# EAGLE design head board (EAGLE 7.5.0)
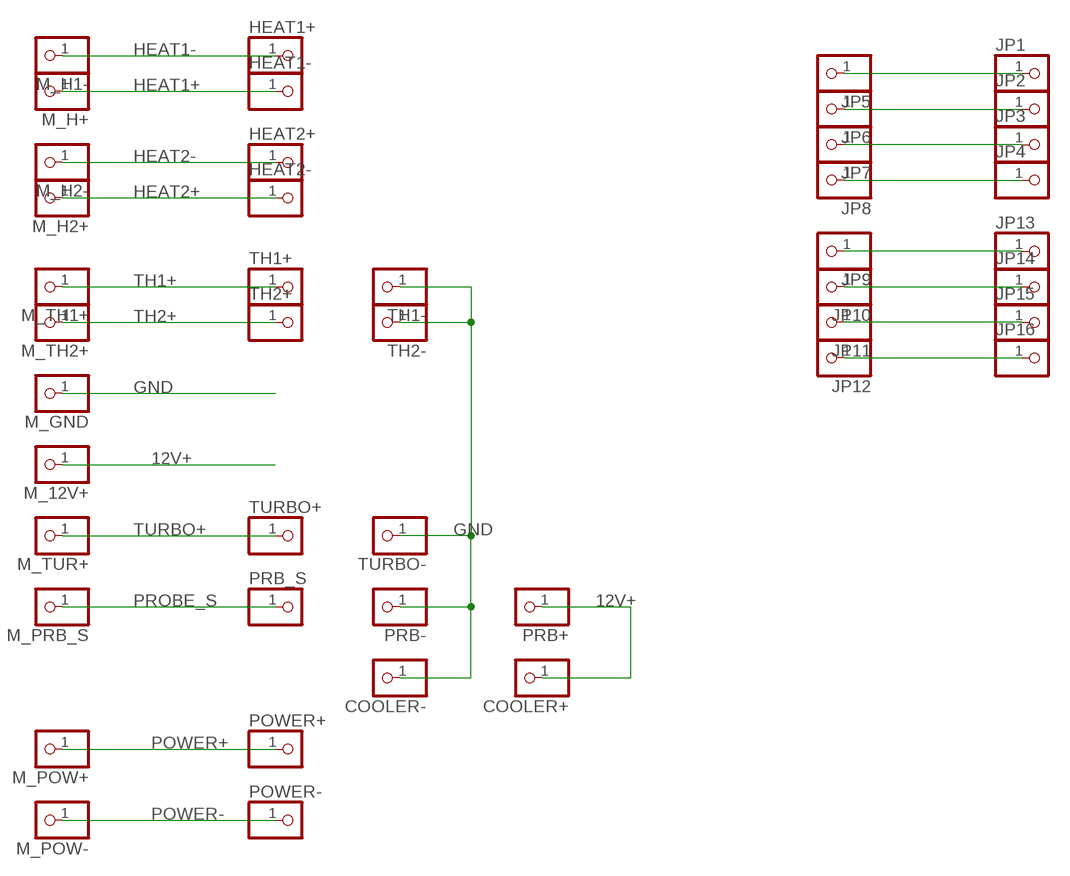
[diagram p0: schematic, sheet 1]

## Parts
COOLER+  PINHD-1X1  [1X01]
COOLER-  PINHD-1X1  [1X01]
HEAT1+  PINHD-1X1  [1X01]
HEAT1-  PINHD-1X1  [1X01]
HEAT2+  PINHD-1X1  [1X01]
HEAT2-  PINHD-1X1  [1X01]
JP1  PINHD-1X1  [1X01]
JP2  PINHD-1X1  [1X01]
JP3  PINHD-1X1  [1X01]
JP4  PINHD-1X1  [1X01]
JP5  PINHD-1X1  [1X01]
JP6  PINHD-1X1  [1X01]
JP7  PINHD-1X1  [1X01]
JP8  PINHD-1X1  [1X01]
JP9  PINHD-1X1  [1X01]
JP10  PINHD-1X1  [1X01]
JP11  PINHD-1X1  [1X01]
JP12  PINHD-1X1  [1X01]
JP13  PINHD-1X1  [1X01]
JP14  PINHD-1X1  [1X01]
JP15  PINHD-1X1  [1X01]
JP16  PINHD-1X1  [1X01]
M_12V+  PINHD-1X1  [1X01]
M_GND  PINHD-1X1  [1X01]
M_H1-  PINHD-1X1  [1X01]
M_H2+  PINHD-1X1  [1X01]
M_H2-  PINHD-1X1  [1X01]
M_H+  PINHD-1X1  [1X01]
M_POW+  PINHD-1X1  [1X01]
M_POW-  PINHD-1X1  [1X01]
M_PRB_S  PINHD-1X1  [1X01]
M_TH1+  PINHD-1X1  [1X01]
M_TH2+  PINHD-1X1  [1X01]
M_TUR+  PINHD-1X1  [1X01]
POWER+  PINHD-1X1  [1X01]
POWER-  PINHD-1X1  [1X01]
PRB+  PINHD-1X1  [1X01]
PRB-  PINHD-1X1  [1X01]
PRB_S  PINHD-1X1  [1X01]
TH1+  PINHD-1X1  [1X01]
TH1-  PINHD-1X1  [1X01]
TH2+  PINHD-1X1  [1X01]
TH2-  PINHD-1X1  [1X01]
TURBO+  PINHD-1X1  [1X01]
TURBO-  PINHD-1X1  [1X01]

## Nets
12V+: COOLER+.1 M_12V+.1 PRB+.1
GND: COOLER-.1 M_GND.1 PRB-.1 TH1-.1 TH2-.1 TURBO-.1
HEAT1+: HEAT1-.1 M_H+.1
HEAT1-: HEAT1+.1 M_H1-.1
HEAT2+: HEAT2-.1 M_H2+.1
HEAT2-: HEAT2+.1 M_H2-.1
N$1: JP1.1 JP5.1
N$2: JP2.1 JP6.1
N$3: JP3.1 JP7.1
N$4: JP4.1 JP8.1
N$5: JP9.1 JP13.1
N$6: JP10.1 JP14.1
N$7: JP11.1 JP15.1
N$8: JP12.1 JP16.1
POWER+: M_POW+.1 POWER+.1
POWER-: M_POW-.1 POWER-.1
PROBE_S: M_PRB_S.1 PRB_S.1
TH1+: M_TH1+.1 TH1+.1
TH2+: M_TH2+.1 TH2+.1
TURBO+: M_TUR+.1 TURBO+.1

## Library data of the parts
COOLER+ COOLER- HEAT1+ HEAT1- HEAT2+ HEAT2- JP1-JP16 M_12V+ M_GND M_H1- M_H2+ M_H2- M_H+ M_POW+ M_POW- M_PRB_S M_TH1+ M_TH2+ M_TUR+ POWER+ POWER- PRB+ PRB- PRB_S TH1+ TH1- TH2+ TH2- TURBO+ TURBO- = adafruit:PINHD-1X1: Pin header 1x1 for 0.1" spacing With round pins

## Board
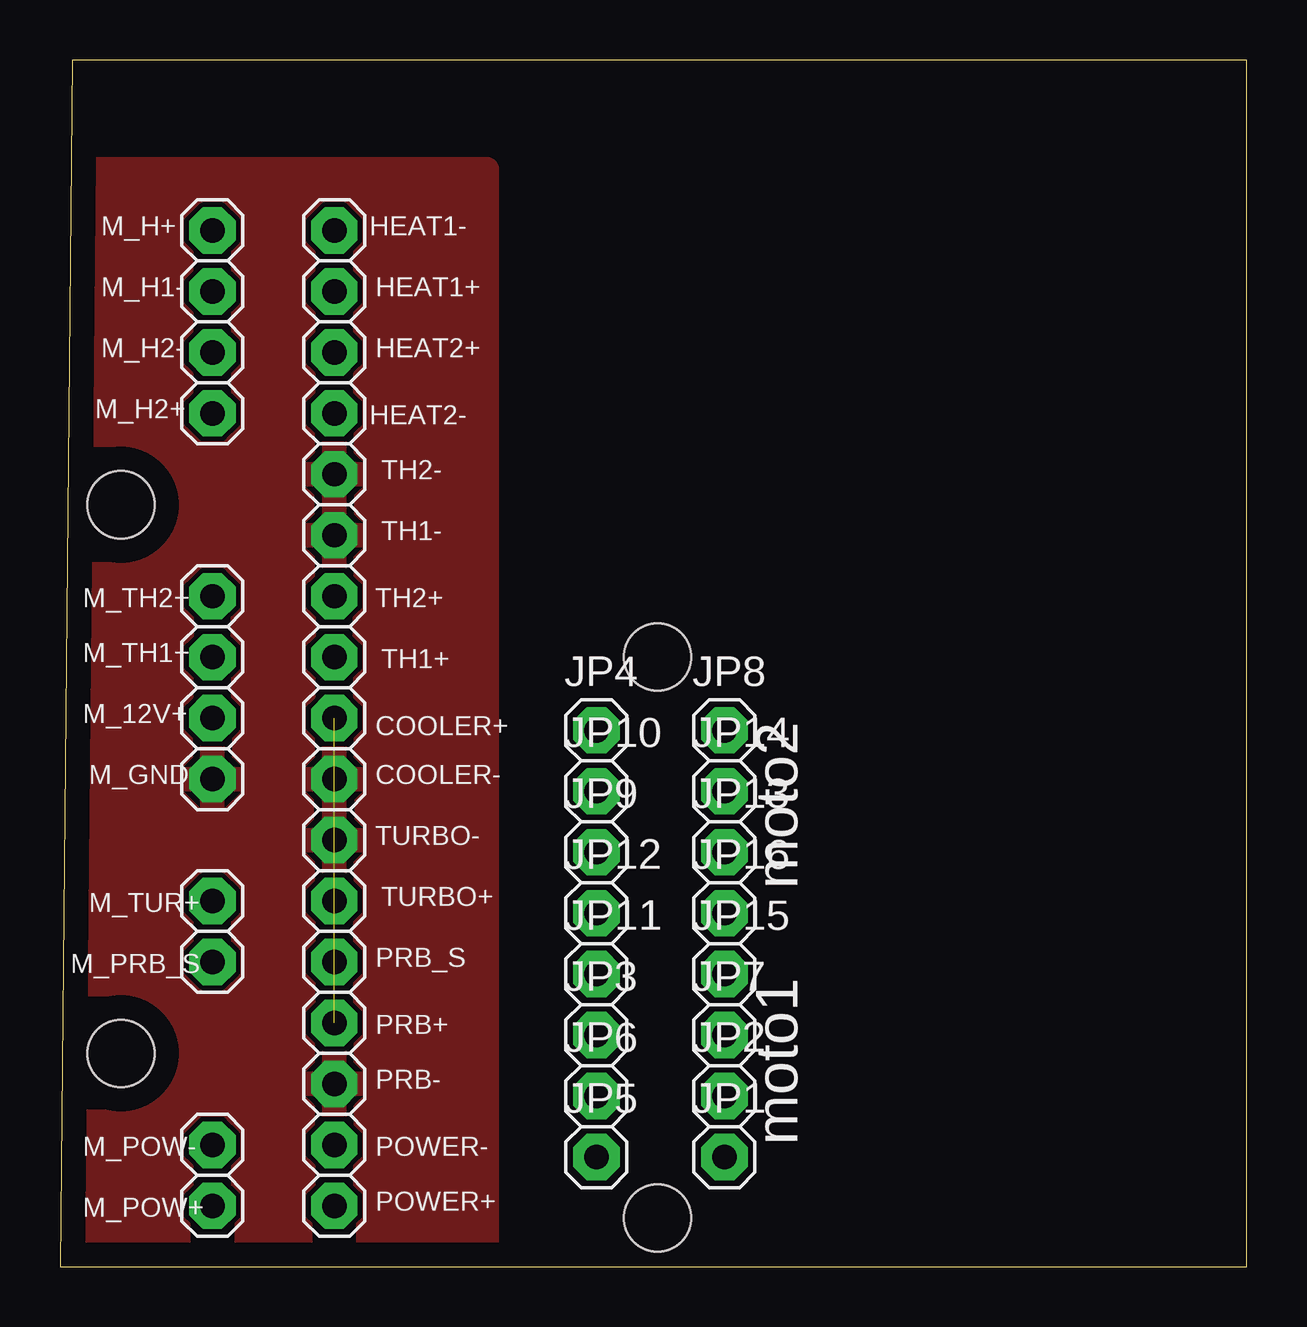
[diagram p1: board, top side]
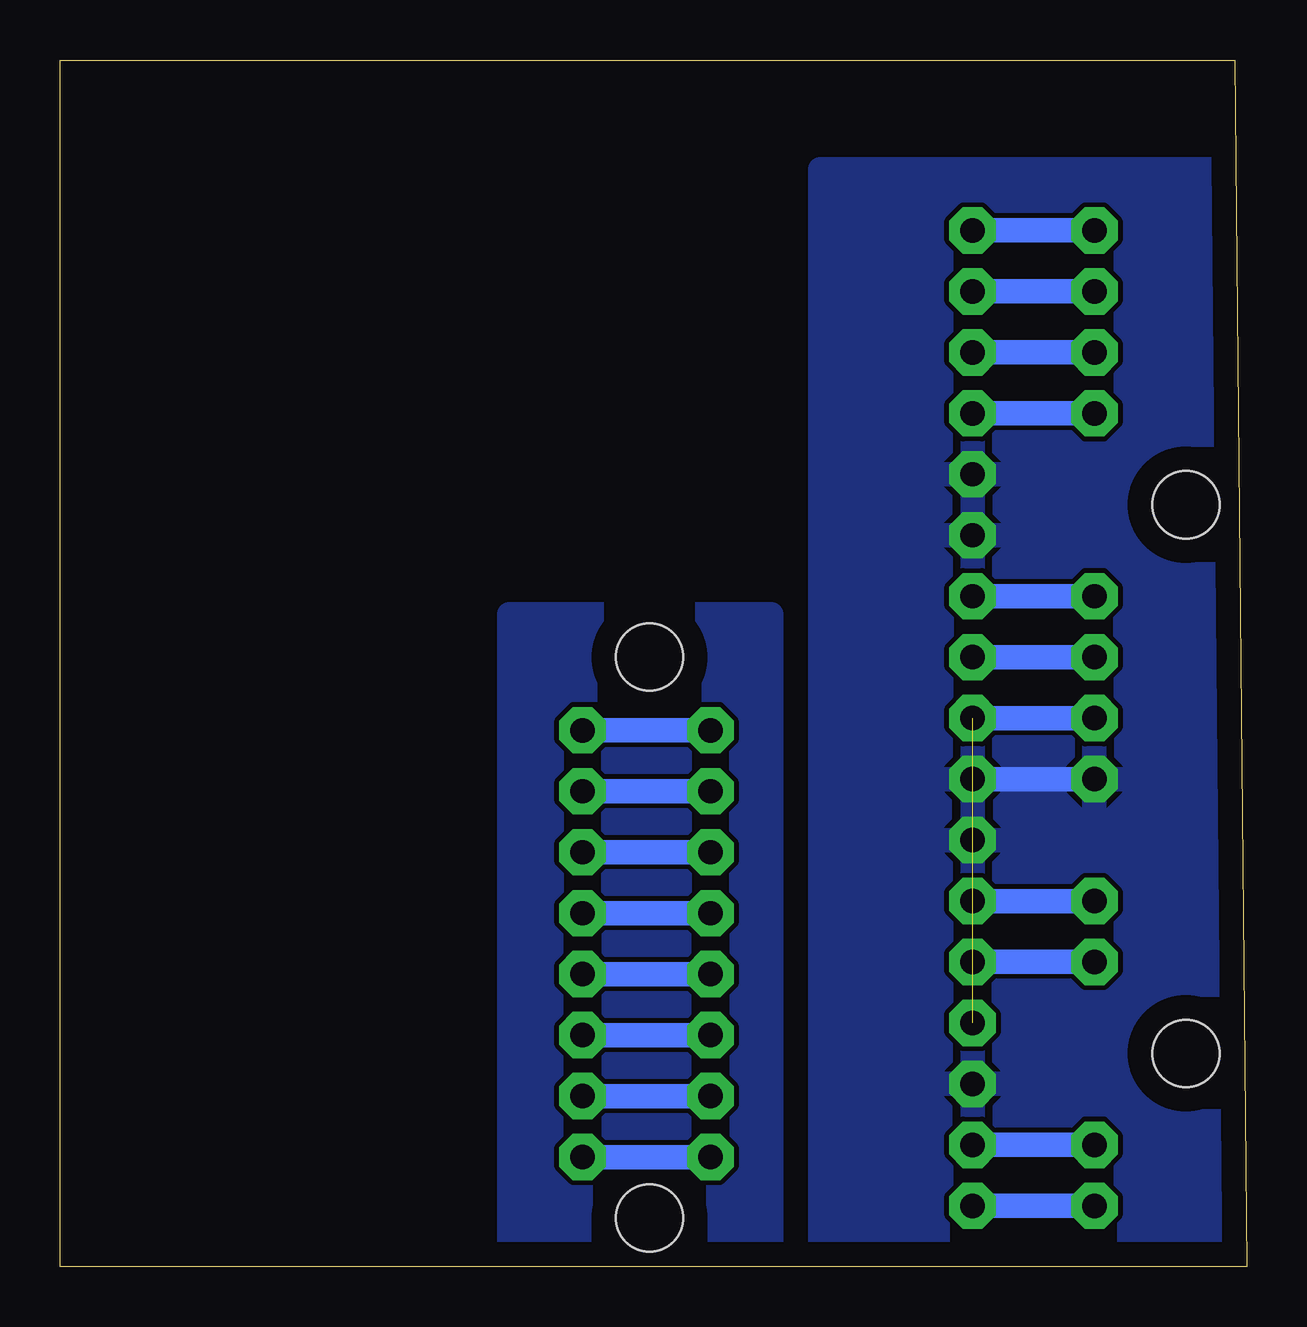
[diagram p2: board, bottom side, seen from below]

Size 49.45 x 50.28 mm. Coordinates in mm from the lower left corner, seen from the top.
Outline: 0,0 49.45,0 49.45,50.28 0.51,50.28 0,0
Copper layers (1*16): Top 0.035mm / dielectric 1.5mm / Bottom 0.035mm
Design rules "default": minimum track width 10mil, minimum drill 24mil, track to track 8mil, track to pad 8mil, pad to pad 8mil, via to via 8mil, smd to smd 8mil, copper to edge 40mil, drill to drill 8mil, minimum pad ring 10mil, minimum via ring 8mil, stop-mask expansion 4mil, vias tented up to drill 0mil, thermal gap 10mil
Holes 2.8 mm at 2.54,31.75 2.54,8.89 24.89,2.03 24.89,25.4

### Footprints (pad centres in the part's own frame; a part is rotated, then mirrored left to right if it is on the bottom)
1X01 = drill 1.016 pad 1.93 octagon: 1 0,0

### Placement (x,y rotation side)
COOLER+  11.43,22.86 0 top
COOLER-  11.43,20.32 0 top
HEAT1+  11.43,40.64 0 top
HEAT1-  11.43,43.18 0 top
HEAT2+  11.43,38.1 0 top
HEAT2-  11.43,35.56 0 top
JP1  27.69,4.57 0 top
JP2  27.69,7.11 0 top
JP3  22.35,9.65 0 top
JP4  22.35,22.35 0 top
JP5  22.35,4.57 0 top
JP6  22.35,7.11 0 top
JP7  27.69,9.65 0 top
JP8  27.69,22.35 0 top
JP9  22.35,17.27 0 top
JP10  22.35,19.81 0 top
JP11  22.35,12.19 0 top
JP12  22.35,14.73 0 top
JP13  27.69,17.27 0 top
JP14  27.69,19.81 0 top
JP15  27.69,12.19 0 top
JP16  27.69,14.73 0 top
M_12V+  6.35,22.86 0 top
M_GND  6.35,20.32 0 top
M_H1-  6.35,40.64 0 top
M_H2+  6.35,35.56 0 top
M_H2-  6.35,38.1 0 top
M_H+  6.35,43.18 0 top
M_POW+  6.35,2.54 0 top
M_POW-  6.35,5.08 0 top
M_PRB_S  6.35,12.7 0 top
M_TH1+  6.35,25.4 0 top
M_TH2+  6.35,27.94 0 top
M_TUR+  6.35,15.24 0 top
POWER+  11.43,2.54 0 top
POWER-  11.43,5.08 0 top
PRB+  11.43,10.16 0 top
PRB-  11.43,7.62 0 top
PRB_S  11.43,12.7 0 top
TH1+  11.43,25.4 0 top
TH1-  11.43,30.48 0 top
TH2+  11.43,27.94 0 top
TH2-  11.43,33.02 0 top
TURBO+  11.43,15.24 0 top
TURBO-  11.43,17.78 0 top

### Tracks (layer width: path | path; a pad name or v marks a point on that pad's centre or on a via)
12V+  (1 unrouted)
  Bottom 1.016: M_12V+.1 COOLER+.1
GND
  Bottom 1.016: M_GND.1 COOLER-.1
  pour Bottom: 0,0 17.78,0 17.78,45.72 0,45.72
  pour Top: 0,0 17.78,0 17.78,45.72 0,45.72
HEAT1+
  Bottom 1.016: M_H+.1 HEAT1-.1
HEAT1-
  Bottom 1.016: M_H1-.1 HEAT1+.1
HEAT2+
  Bottom 1.016: M_H2+.1 HEAT2-.1
HEAT2-
  Bottom 1.016: M_H2-.1 HEAT2+.1
N$1
  Bottom 1.016: JP5.1 JP1.1
N$2
  Bottom 1.016: JP6.1 JP2.1
N$3
  Bottom 1.016: JP3.1 JP7.1
N$4
  Bottom 1.016: JP4.1 JP8.1
N$5
  Bottom 1.016: JP9.1 JP13.1
N$6
  Bottom 1.016: JP10.1 JP14.1
N$7
  Bottom 1.016: JP11.1 JP15.1
N$8
  Bottom 1.016: JP12.1 JP16.1
N$9
  pour Bottom: 20.57,0 30.73,0 30.73,27.18 19.81,27.18 19.81,0
POWER+
  Bottom 1.016: M_POW+.1 POWER+.1
POWER-
  Bottom 1.016: M_POW-.1 POWER-.1
PROBE_S
  Bottom 1.016: M_PRB_S.1 PRB_S.1
TH1+
  Bottom 1.016: M_TH1+.1 TH1+.1
TH2+
  Bottom 1.016: M_TH2+.1 TH2+.1
TURBO+
  Bottom 1.016: M_TUR+.1 TURBO+.1

### Text on the board
tNames: moto2 | moto1